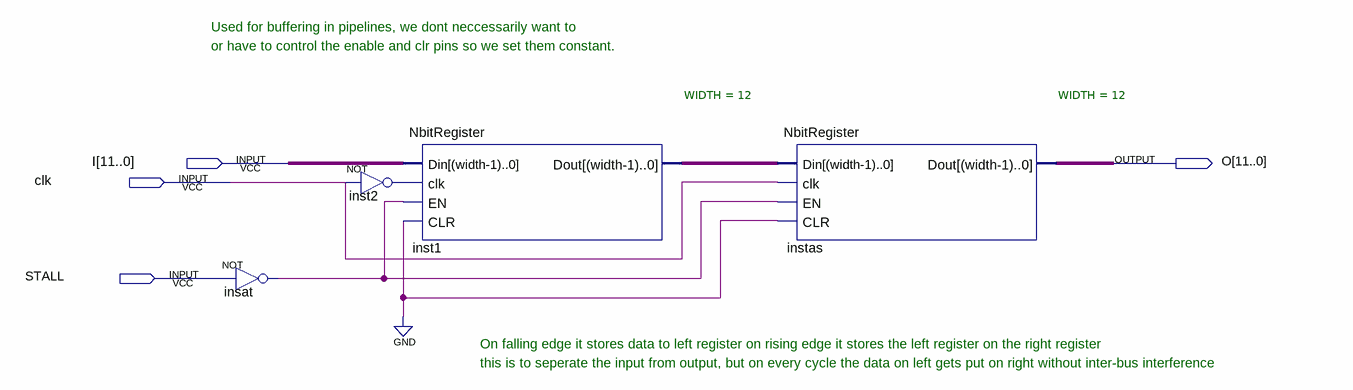
[diagram p0: schematic sheet]
// Quartus schematic 12bitR.bdf as structural Verilog: 4 symbols, 4 pins
module \12bitR  (
  input  [11:0] I,
  input  clk,
  input  STALL,
  output [11:0] O
);

  wire insat_out, inst2_out;
  wire [11:0] inst1_dout;

  not insat (insat_out, STALL);
  not inst2 (inst2_out, clk);
  NbitRegister #(.WIDTH(12)) inst1 (.Din(I), .clk(inst2_out), .EN(insat_out), .CLR(1'b0), .Dout(inst1_dout));
  NbitRegister #(.WIDTH(12)) instas (.Din(inst1_dout), .clk(clk), .EN(insat_out), .CLR(1'b0), .Dout(O));

  // Notes on the sheet:
  //   Used for buffering in pipelines, we dont neccessarily want to
  //   or have to control the enable and clr pins so we set them constant.
  //   On falling edge it stores data to left register on rising edge it stores the left register on the right register
  //   this is to seperate the input from output, but on every cycle the data on left gets put on right without inter-bus interference
endmodule
